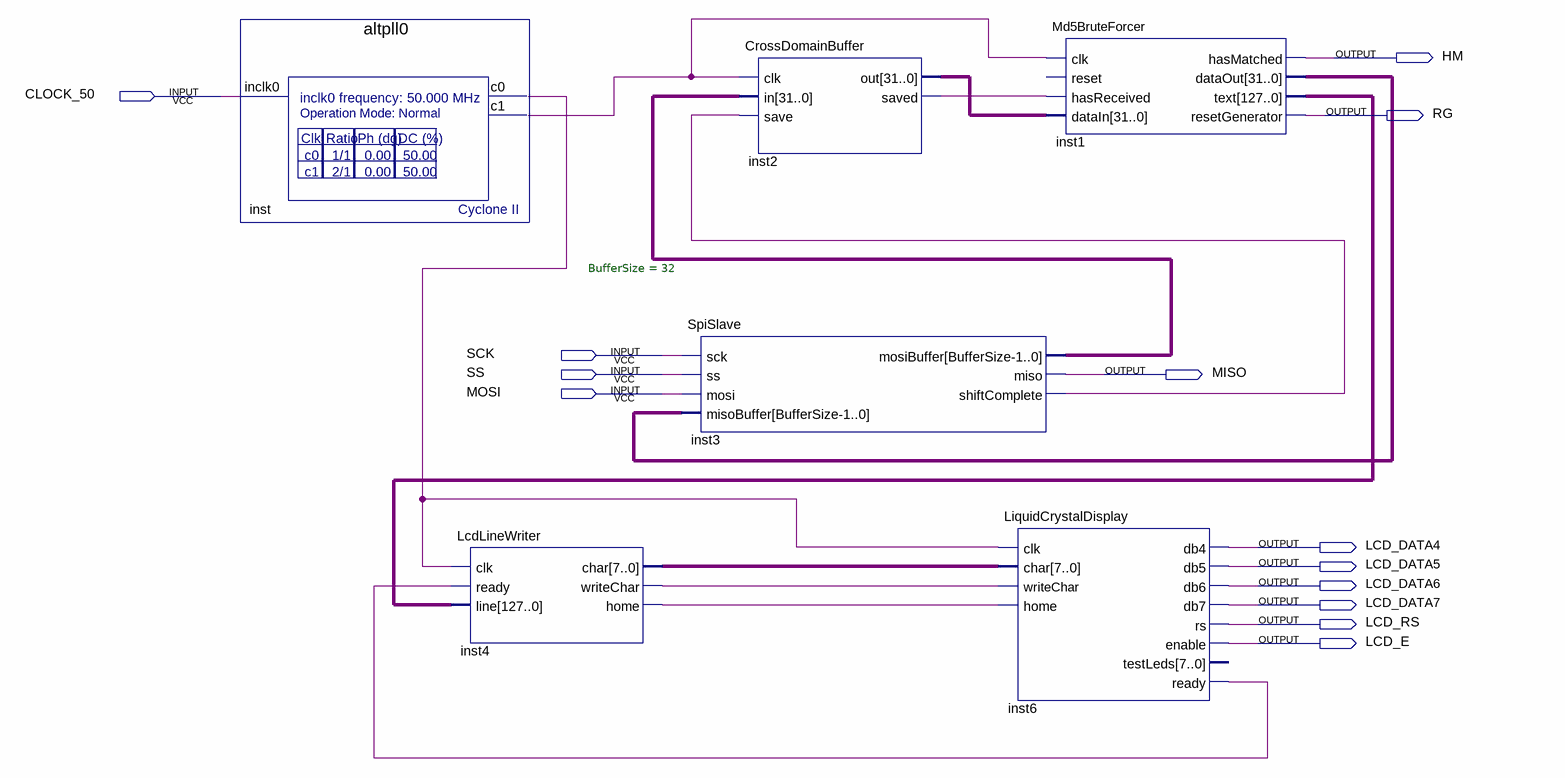
[diagram p0: schematic sheet]
// Quartus schematic DE1_fpga_md5.bdf as structural Verilog: 6 symbols, 13 pins
module DE1_fpga_md5 (
  input  CLOCK_50,
  input  SCK,
  input  SS,
  input  MOSI,
  output HM,
  output RG,
  output MISO,
  output LCD_DATA4,
  output LCD_DATA5,
  output LCD_DATA6,
  output LCD_DATA7,
  output LCD_RS,
  output LCD_E
);

  wire inst2_saved, inst3_shiftcomplete, inst4_home, inst4_writechar, inst6_ready, inst_c0, inst_c1;
  wire [7:0] inst4_char;
  wire [31:0] inst1_dataout, inst2_out, inst3_mosibuffer;
  wire [127:0] inst1_text;

  altpll0 inst (.inclk0(CLOCK_50), .c0(inst_c0), .c1(inst_c1));
  LcdLineWriter inst4 (
    .clk(inst_c0), .ready(inst6_ready), .line(inst1_text), .char(inst4_char), .writeChar(inst4_writechar),
    .home(inst4_home));
  CrossDomainBuffer inst2 (
    .clk(inst_c1), .in(inst3_mosibuffer), .save(inst3_shiftcomplete), .out(inst2_out), .saved(inst2_saved));
  SpiSlave #(.BufferSize(32)) inst3 (
    .sck(SCK), .ss(SS), .mosi(MOSI), .misoBuffer(inst1_dataout), .mosiBuffer(inst3_mosibuffer), .miso(MISO),
    .shiftComplete(inst3_shiftcomplete));
  Md5BruteForcer inst1 (
    .clk(inst_c1), .hasReceived(inst2_saved), .dataIn(inst2_out), .hasMatched(HM), .dataOut(inst1_dataout),
    .text(inst1_text), .resetGenerator(RG));  // open: reset
  LiquidCrystalDisplay inst6 (
    .clk(inst_c0), .char(inst4_char), .writeChar(inst4_writechar), .home(inst4_home), .db4(LCD_DATA4),
    .db5(LCD_DATA5), .db6(LCD_DATA6), .db7(LCD_DATA7), .rs(LCD_RS), .enable(LCD_E), .ready(inst6_ready));  // open: testLeds
endmodule
